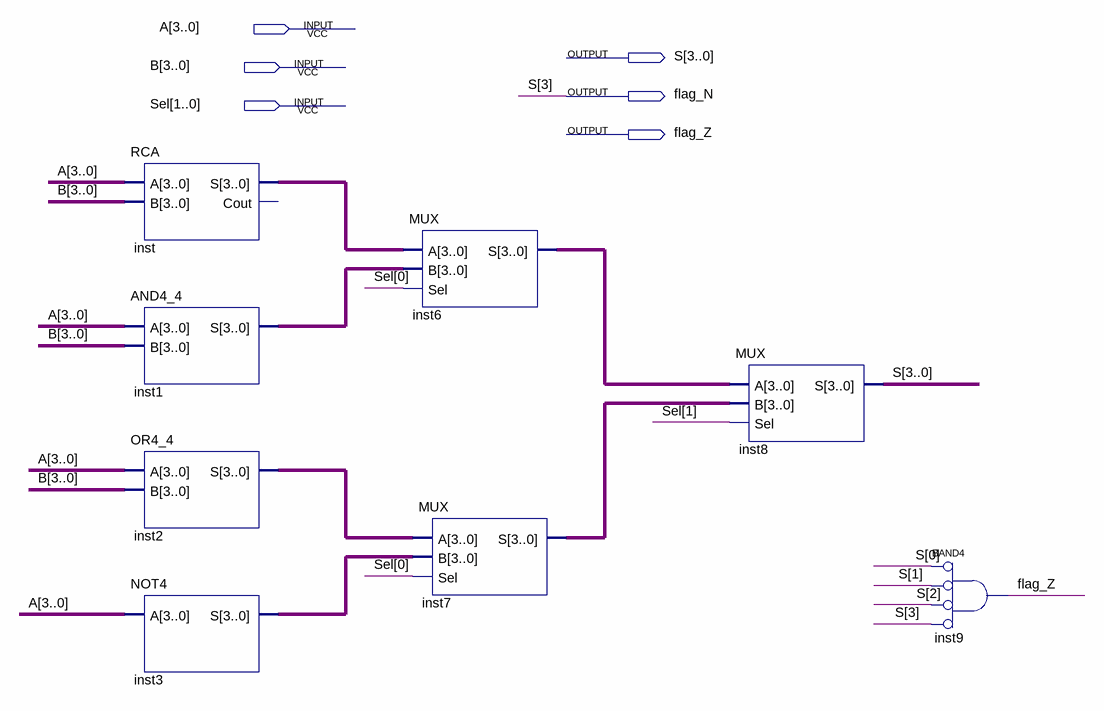
[diagram p0: schematic sheet]
// Quartus schematic ULA.bdf as structural Verilog: 8 symbols, 6 pins
module ULA (
  input  [3:0] A,
  input  [3:0] B,
  input  [1:0] Sel,
  output [3:0] S,
  output flag_N,
  output flag_Z
);

  wire [3:0] inst1_s, inst2_s, inst3_s, inst6_s, inst7_s, inst_s;

  RCA inst (.A(A), .B(B), .S(inst_s));  // open: Cout
  AND4_4 inst1 (.A(A), .B(B), .S(inst1_s));
  OR4_4 inst2 (.A(A), .B(B), .S(inst2_s));
  NOT4 inst3 (.A(A), .S(inst3_s));
  MUX inst6 (.A(inst_s), .B(inst1_s), .Sel(Sel[0]), .S(inst6_s));
  MUX inst7 (.A(inst2_s), .B(inst3_s), .Sel(Sel[0]), .S(inst7_s));
  MUX inst8 (.A(inst6_s), .B(inst7_s), .Sel(Sel[1]), .S({flag_N, S[2:0]}));
  and inst9 (flag_Z, ~S[0], ~S[1], ~S[2], ~flag_N);  // BAND4

  assign S[3] = flag_N;
endmodule
